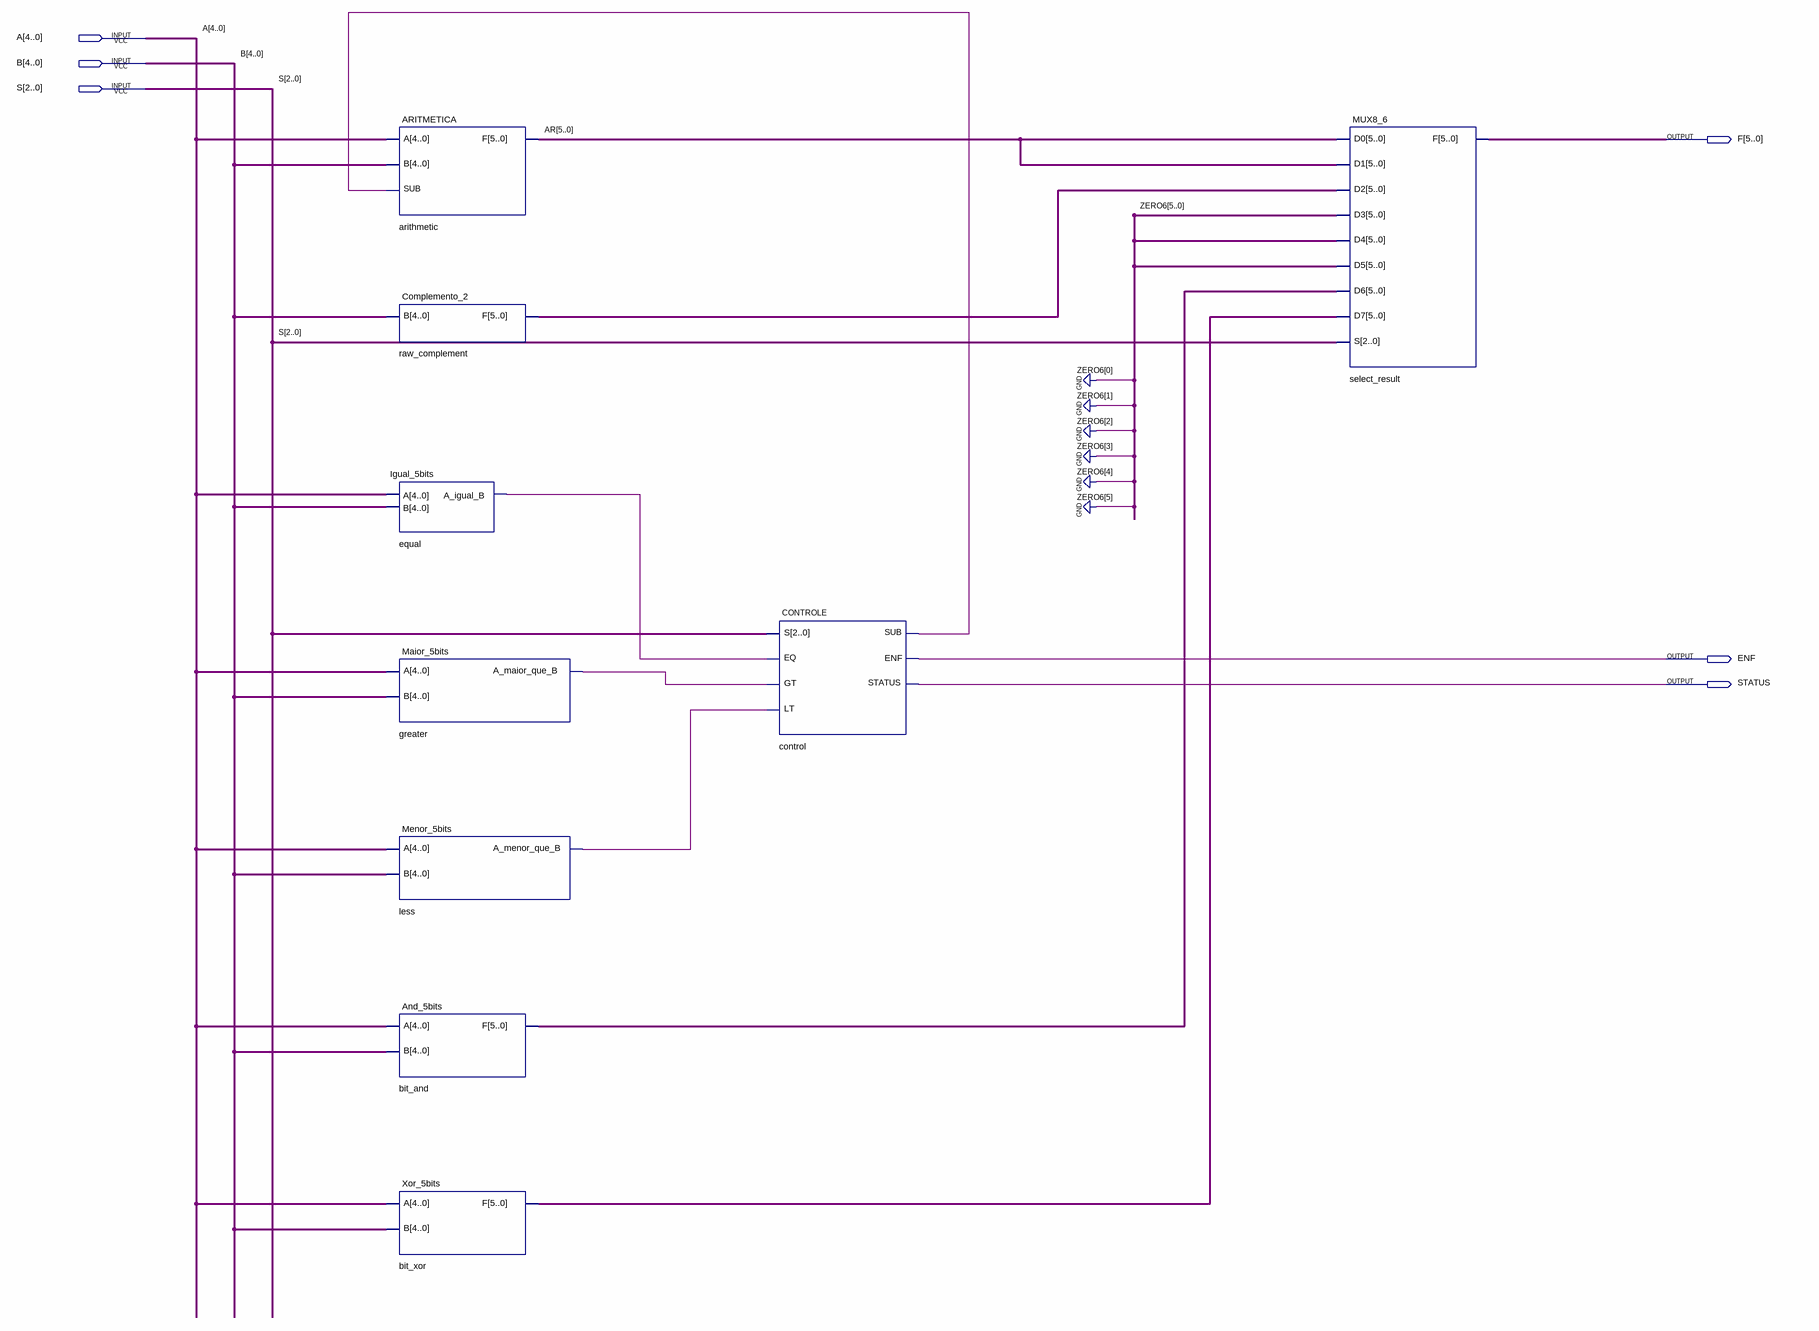
[diagram p0: schematic sheet]
// Quartus schematic ULA.bdf as structural Verilog: 9 symbols, 6 pins
module ULA (
  input  [4:0] A,
  input  [4:0] B,
  input  [2:0] S,
  output [5:0] F,
  output ENF,
  output STATUS
);

  wire control_sub, equal_a_igual_b, greater_a_maior_que_b, less_a_menor_que_b;
  wire [5:0] AR, bit_and_f, bit_xor_f, raw_complement_f;

  ARITMETICA arithmetic (.A(A), .B(B), .SUB(control_sub), .F(AR));
  Complemento_2 raw_complement (.B(B), .F(raw_complement_f));
  Igual_5bits equal (.A(A), .B(B), .A_igual_B(equal_a_igual_b));
  Maior_5bits greater (.A(A), .B(B), .A_maior_que_B(greater_a_maior_que_b));
  Menor_5bits less (.A(A), .B(B), .A_menor_que_B(less_a_menor_que_b));
  And_5bits bit_and (.A(A), .B(B), .F(bit_and_f));
  Xor_5bits bit_xor (.A(A), .B(B), .F(bit_xor_f));
  CONTROLE control (
    .S(S), .EQ(equal_a_igual_b), .GT(greater_a_maior_que_b), .LT(less_a_menor_que_b), .SUB(control_sub),
    .ENF(ENF), .STATUS(STATUS));
  MUX8_6 select_result (
    .D0(AR), .D1(AR), .D2(raw_complement_f), .D3({6{1'b0}}), .D4({6{1'b0}}), .D5({6{1'b0}}), .D6(bit_and_f),
    .D7(bit_xor_f), .S(S), .F(F));
endmodule
